# EAGLE schematic Schematic (EAGLE 7.3.0)
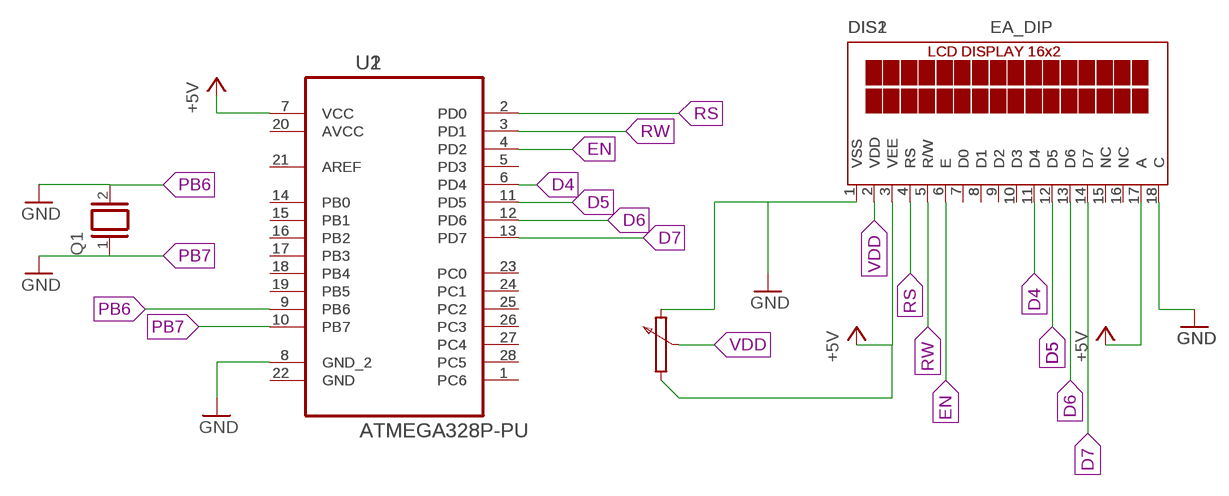
[diagram p0: schematic, sheet 1]

## Parts
DIS1  EA_DIP  [EA_DIP]
DIS2  EA_DIP  [EA_DIP]
Q1  XTAL/S  [QS]
U1  ATMEGA328P-PU  [DIP254P762X457-28]
U2  ATMEGA328P-PU  [DIP254P762X457-28]

## Nets
+5V: DIS1.3(VEE) DIS1.17(A) DIS2.3(VEE) DIS2.17(A) U1.7(VCC) U2.7(VCC)
D4: DIS1.11(D4) DIS2.11(D4) U1.6(PD4) U2.6(PD4)
D5: DIS1.12(D5) DIS2.12(D5) U1.11(PD5) U2.11(PD5)
D6: DIS1.13(D6) DIS2.13(D6) U1.12(PD6) U2.12(PD6)
D7: DIS1.14(D7) DIS2.14(D7) U1.13(PD7) U2.13(PD7)
EN: DIS1.6(E) DIS2.6(E) U1.4(PD2) U2.4(PD2)
GND: DIS1.1(VSS) DIS1.18(C) DIS2.1(VSS) DIS2.18(C) U1.8(GND_2) U2.8(GND_2)
N$2: U1.20(AVCC) U2.20(AVCC)
N$3: U1.21(AREF) U2.21(AREF)
N$4: U1.14(PB0) U2.14(PB0)
N$5: U1.15(PB1) U2.15(PB1)
N$6: U1.16(PB2) U2.16(PB2)
N$7: U1.17(PB3) U2.17(PB3)
N$8: U1.18(PB4) U2.18(PB4)
N$9: U1.19(PB5) U2.19(PB5)
N$13: U1.22(GND) U2.22(GND)
N$17: U1.5(PD3) U2.5(PD3)
N$22: U1.23(PC0) U2.23(PC0)
N$23: U1.24(PC1) U2.24(PC1)
N$24: U1.25(PC2) U2.25(PC2)
N$25: U1.26(PC3) U2.26(PC3)
N$26: U1.27(PC4) U2.27(PC4)
N$27: U1.28(PC5) U2.28(PC5)
N$28: U1.1(PC6) U2.1(PC6)
N$29: DIS1.7(D0) DIS2.7(D0)
N$30: DIS1.8(D1) DIS2.8(D1)
N$31: DIS1.9(D2) DIS2.9(D2)
N$32: DIS1.10(D3) DIS2.10(D3)
N$37: DIS1.15(NC) DIS2.15(NC)
N$38: DIS1.16(NC) DIS2.16(NC)
PB6: Q1.2 U1.9(PB6) U2.9(PB6) ; supply symbol labelled GND
PB7: Q1.1 U1.10(PB7) U2.10(PB7) ; supply symbol labelled GND
RS: DIS1.4(RS) DIS2.4(RS) U1.2(PD0) U2.2(PD0)
RW: DIS1.5(R/W) DIS2.5(R/W) U1.3(PD1) U2.3(PD1)
VDD: DIS1.2(VDD) DIS2.2(VDD)

## Library data of the parts
DIS1 DIS2 = display-lcd:EA_DIP: LCD-MODUL 2x16 - 6,68mm, INKL. KONTROLLER HD44780 Source: Data sheet <http://www.lcd-module.de/pdf/doma/dip162-d.pdf>
Q1 = special:XTAL/S: CRYSTAL
U1 U2 = Atmel_By_element14_Batch_1-00:ATMEGA328P-PU: 8-bit Microcontroller with In-System Programmable Flash; MPN: ATMEGA328P-PU; OC_FARNELL: 1715487; OC_NEWARK: 15R0268; PACKAGE: PDIP-28; SUPPLIER: Atmel